# Altium schematic sheet schematic.SchDoc
size A4; SheetNumber: 1; SheetTotal: 1
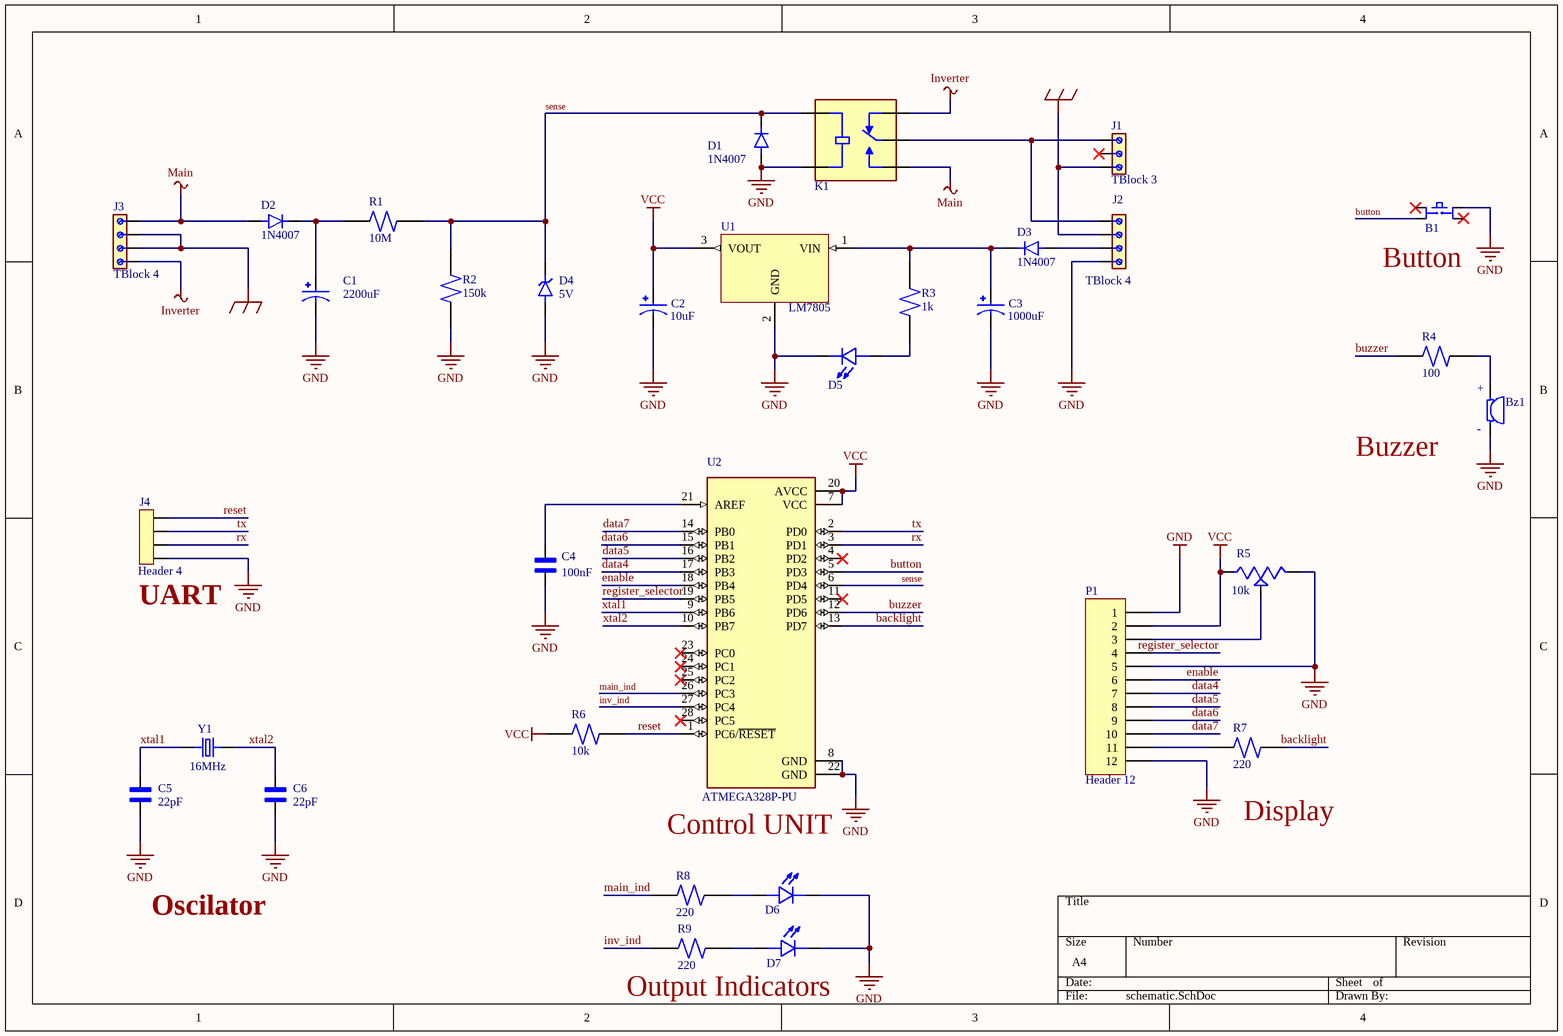
[diagram p0: schematic.SchDoc]

## Parts
B1  Push button  [SW_TS02-66-95-BK-260-LCR-D]  (value not drawn)
Bz1  AI-1223-TWT-12V-R  [XDCR_AI-1223-TWT-12V-R]  (value not drawn)
C1  2200uF  [CAPPRD750W80D1600H2500]
C2  10uF  [CAPPRD500W50D500H1100]
C3  1000uF  [CAPPRD500W50D500H1100]
C4  100nF  [CAPRB500W50L450T300H550]
C5  22pF  [CAPRB500W50L450T300H550]
C6  22pF  [CAPRB500W50L450T300H550]
D1  1N4007  [DIOAD1060W80L520D270]
D2  1N4007  [DIOAD1060W80L520D270]
D3  1N4007  [DIOAD1060W80L520D270]
D4  5V  [DIOAD1060W70L435D230]
D5  L08R5000Q1  [LEDRD254W57D500H1070]  (value not drawn)
D6  L08R5000Q1  [LEDRD254W57D500H1070]  (value not drawn)
D7  L08R5000Q1  [LEDRD254W57D500H1070]  (value not drawn)
J1  TBlock 3  [Terminal block - 3Pins]
J2  TBlock 4  [691241510004]
J3  TBlock 4  [691241510004]
J4  Header 4  [SULLINS_PPTC041LFBN-RC]
K1  JQC-3F-1C-24VDC  [RELAY_JQC-3F-1C-24VDC]  (value not drawn)
P1  Header 12  [HDR1X12]
R1  10M  [RESAD1100W55L680D260]
R2  150k  [RESAD1100W55L680D260]
R3  1k  [RESAD1100W55L680D260]
R4  100  [RESAD1100W55L680D260]
R5  10k  [TRIM_3306F-1-105]
R6  10k  [RESAD1100W55L680D260]
R7  220  [RESAD1100W55L680D260]
R8  220  [RESAD1100W55L680D260]
R9  220  [RESAD1100W55L680D260]
U1  LM7805  [TO255P1020X450X1968-3]
U2  ATMEGA328P-PU  [DIP794W46P254L2967H457Q28B]
Y1  16MHz  [XTAL_ECS-160-20-4X]

## Nets
AGND: J1.3 J2.2 J3.2 J3.3
GND: B1.3 Bz1.N(NEG) C1.N C2.N C3.N C4.1 C5.1 C6.1 D1.A D4.A D5.C D6.C D7.C J2.4 J4.4 K1.COIL2 P1.1 P1.5 P1.12 R2.2 R5.3(CW) U1.2(GND) U2.8(GND) U2.22(GND)
Inverter: J3.4 K1.NC
Main: D2.A J3.1 K1.NO
VCC: C2.P P1.2 R5.1(CCW) R6.2 U1.3(VOUT) U2.7(VCC) U2.20(AVCC)
backlight: R7.2 U2.13(PD7)
button: B1.2 U2.5(PD3)
buzzer: R4.1 U2.12(PD6)
data4: P1.7 U2.17(PB3)
data5: P1.8 U2.16(PB2)
data6: P1.9 U2.15(PB1)
data7: P1.10 U2.14(PB0)
enable: P1.6 U2.18(PB4)
inv_ind: R9.2 U2.27(PC4)
main_ind: R8.2 U2.26(PC3)
register_selector: P1.4 U2.19(PB5)
reset: J4.1 R6.1 U2.1(PC6/~{RESET})
rx: J4.3 U2.3(PD1)
sense: D1.C D4.C(K) K1.COIL1 R1.1 R2.1 U2.6(PD4)
tx: J4.2 U2.2(PD0)
xtal1: C5.2 U2.9(PB6) Y1.2
xtal2: C6.2 U2.10(PB7) Y1.1
NetBz1_P: Bz1.P(POS) R4.2
NetC1_P: C1.P D2.C R1.2
NetC3_P: C3.P D3.C R3.2 U1.1(VIN)
NetC4_2: C4.2 U2.21(AREF)
NetD3_A: D3.A J2.3
NetD5_A: D5.A R3.1
NetD6_A: D6.A R8.1
NetD7_A: D7.A R9.1
NetJ1_1: J1.1 J2.1 K1.COM
NetP1_3: P1.3 R5.2(WIPER)
NetP1_11: P1.11 R7.1

Not connected (* = marked no-connect by the designer): B1 1* 4*; J1 2*; U2 4(PD2)* 11(PD5)* 23(PC0)* 24(PC1)* 25(PC2)* 28(PC5)*

## Notes on the sheet
- (near B1) Button
- Buzzer
- (near J4) UART
- Control UNIT
- (near R7) Display
- Oscilator
- Output Indicators
- (in symbol Buzzer) +; -

## Library data of the parts
Bz1 = Buzzer: ELECTRO-MECHANICAL AUDIO INDICATOR; MF: PUI Audio,; Availability: In Stock; Package: 2225 PUI Audio; Value: *; Price: None; MP: AI-1223-TWT-12V-R; Purchase-URL: https://pricing.snapeda.com/search/part/AI-1223-TWT-12V-R/?ref=eda
C1 = Capacitor (16 x 25mm): Cap Aluminum 33uF 400V 20% (16 X 25mm) Radial Aluminum Cylindrical Can 7.5mm 275mA 2000 hr 85Â°C Bulk; MF: Panasonic; MP: ECA2GM330; Value: *; Price: None; Package: RADIAL-2 Panasonic; Check_prices: https://www.snapeda.com/parts/ECA2GM330/Panasonic/view-part/5790262/?ref=eda; Availability: In Stock; SnapEDA_Link: https://www.snapeda.com/parts/ECA2GM330/Panasonic/view-part/5790262/?ref=snap; Purchase-URL: https://pricing.snapeda.com/search/part/ECA2GM330/?ref=eda
C2 C3 = Electrolytic capacitor: FS-A; MF: {'manufacturer': u'Panasonic'}; MP: EEUFS0J221B; Package: None; Value: *; Availability: Unavailable; Price: None
C4-C6 = Ceramic capacitor: 2200 pF Â±10% 250V Ceramic Capacitor X7R Radial; MF: TDK; MP: FG24X7R2E222KNT06; Digi-Key_Part_Number: 445-173386-1-ND; Purchase-URL: https://pricing.snapeda.com/search/part/FG24X7R2E222KNT06/?ref=eda; Check_prices: https://www.snapeda.com/parts/FG24X7R2E222KNT06/TDK/view-part/?ref=eda; Value: *; Package: Radial TDK; SnapEDA_Link: https://www.snapeda.com/parts/FG24X7R2E222KNT06/TDK/view-part/?ref=snap
D1-D3 = 1N4007: Diode Switching 1KV 1A 2-Pin DO-41; Price: None; MP: 1N4007; Value: *; Availability: Unavailable; Package: None
D4 = Zenner diode: Zener Diode 16V 1W Â±5% Through Hole DO-204AL (DO-41); MP: 1N4745A; MF: ON Semiconductor; Purchase-URL: https://pricing.snapeda.com/search/part/1N4745A/?ref=eda; Check_prices: https://www.snapeda.com/parts/1N4745A/Onsemi/view-part/?ref=eda; Availability: In Stock; Value: *; Price: None; Package: DO-41-2 ON Semiconductor; SnapEDA_Link: https://www.snapeda.com/parts/1N4745A/Onsemi/view-part/?ref=snap
D5-D7 = LED: LED, Orange, Through Hole, T-1 3/4 (5mm), 30 mA, 2.1 V, 635 nm; MF: {'manufacturer': u'LED Technology'}; Price: None; Package: None; Availability: Unavailable; MP: L08R5000Q1; Value: *
J1 = 3Pins Terminal block: 5.08 MM TERMINAL BLOCK;; MP: 691216510003S; MF: Wurth Electronics; Package: None; Purchase-URL: https://pricing.snapeda.com/search/part/691216510003S/?ref=eda; Check_prices: https://www.snapeda.com/parts/691216510003S/Wurth+Electronics+Inc/view-part/?ref=eda; Availability: In Stock; Price: None; SnapEDA_Link: https://www.snapeda.com/parts/691216510003S/Wurth+Electronics+Inc/view-part/?ref=snap; Value: *
J2 J3 = Terminal block - 4Pins: <b>WR-TBL Serie 2415 - 5.08 mm Horizontal Entry Modular w. Rising Cage Clamp</b> <br> <br><b> KIND PROPERTIES </b> <br><br> Pitch 5.08 mm  <br> <br> <b>MATERIAL PROPERTIES </b> <br> <br>Insulator Material PA66  <br>Insulator Flammability Rating UL94 V-0  <br>Terminal Screw Material Steel  <br>Terminal Screw Plating Zinc  <br>Wire Guard Material Copper Alloy  <br> <br> <b>GENERAL INFORMATION </b> <br> <br>Operating Temperature -30 up to +120 Â°C  <br>Compliance ROHS & Reach  <br><br> <b>ELECTRICAL PROPERTIES </b> <br> <br>IR UL 14 A  <br>IR VDE 24 A  <br>Working Voltage [UL] 300 V (AC)  <br>Working Voltage [VDE] 250 V (AC)  <br>Withstanding Voltage [UL] 1600 V (AC)  <br>Withstanding Voltage [VDE] 2000 V (AC)  <br>Contact Resistance 20 mÎ©  <br> <br> <b>MECHANICAL PROPERTIES </b> <br> <br>Wire Strip Length 6  <br>Screw M3  <br> <br> <b>CERTIFICATION </b> <br> <br>UL Approval E150931  <br>VDE Approval 40021365  <br> <br> <b>PACKAGING PROPERTIES </b> <br> <br>Packaging Box  <br> <br> <br><a href="https://www.we-online.com/catalog/media/o79416v209%20Family_WR-TBL_6912427000xx_6912425000xx.jpg" title="Enlarge picture"> <img src="https://www.we-online.com/catalog/media/o79416v209%20Family_WR-TBL_6912427000xx_6912425000xx.jpg" width="320"></a><p> Details see: <a href="https://www.we-online.com/catalog/en/TBL_5_08_2415_HORIZONTAL_ENTRY_W_RISING_CAGE_6912415100xx/">https://www.we-online.com/catalog/en/TBL_5_08_2415_HORIZONTAL_ENTRY_W_RISING_CAGE_6912415100xx/</a><p>  </b>Updated by Ella Wu  2019-11-26<br> </b>2019(C) Wurth Elektronik; MF: WÃ¼rth Elektronik; MP: 691241510004; SnapEDA_Link: https://www.snapeda.com/parts/691241510004/Wurth+Electronics+Inc./view-part/?ref=snap; Availability: In Stock; Package: None; Purchase-URL: https://pricing.snapeda.com/search/part/691241510004/?ref=eda; Check_prices: https://www.snapeda.com/parts/691241510004/Wurth+Electronics+Inc./view-part/?ref=eda; Value: *; Price: None
J4 = Female header - 4Pins: 4 Position Header Connector Through Hole; MP: PPTC041LFBN-RC; MF: Sullins Connector; Value: *; SnapEDA_Link: https://www.snapeda.com/parts/PPTC041LFBN-RC/Sullins%20Connector%20Solutions/view-part/285917/?ref=snap; Package: None; Availability: Warning; Check_prices: https://www.snapeda.com/parts/PPTC041LFBN-RC/Sullins%20Connector%20Solutions/view-part/285917/?ref=eda; Price: None; Purchase-URL: https://pricing.snapeda.com/search/part/PPTC041LFBN-RC/?ref=eda
K1 = Relay (Standard): Miniature PCB Relay 24VDC, 10A 250VAC, 15A 125VAC, 10A 250VAC; Package: None; MP: JQC-3F-1C-24VDC; Value: *; Price: None; Availability: Unavailable
P1 = Header 12: Header, 12-Pin; LatestRevisionDate: 17-Jul-2002; LatestRevisionNote: Re-released for DXP Platform.; Publisher: Altium Limited
R1-R4 R6-R9 = Resistor (0.25W): (MFR-25FBF52-10K) 10,2 kOhm bei 1% 0,25W, 1/4W Durchbohrlochwiderstand Axial Metal Film; MF: Yageo; Digi-Key_Part_Number: 10.2KXBK-ND; SnapEDA_Link: https://www.snapeda.com/parts/MFR-25FBF52-10K/Yageo/view-part/424333/?ref=snap; Package: Axial Yageo; Purchase-URL: https://pricing.snapeda.com/search/part/MFR-25FBF52-10K/?ref=eda; MP: MFR-25FBF52-10K; Value: *
R5 = Potentiometer1: (3306F-1-105) 1 MOhms 0.2W, 1/5W PC Pins Through Hole Trimmer Potentiometer Cermet 1 Turn Top Adjustment; MF: Bourns; Check_prices: https://www.snapeda.com/parts/3306F-1-105/Bourns%20-%20J.W.%20Miller/view-part/862876/?ref=eda; Availability: Good; Value: *; Price: None; MP: 3306F-1-105; SnapEDA_Link: https://www.snapeda.com/parts/3306F-1-105/Bourns%20-%20J.W.%20Miller/view-part/862876/?ref=snap; Package: 3306F Bourns; Purchase-URL: https://pricing.snapeda.com/search/part/3306F-1-105/?ref=eda
U1 = LM78__: MP: LM7805CT/NOPB; Price: None; Value: *; Availability: Unavailable; Package: None
U2 = ATMEGA328P-PU: ATmega Series 20 MHz 32 KB Flash 2 KB SRAM 8-Bit Microcontroller - DIP-28; Value: *; MP: ATMEGA328P-PU; Package: None; Availability: Unavailable; Price: None
Y1 = Crystal oscilator: CRYSTAL T/H; MF: {'manufacturer': u'ECS Inc.'}; MP: ECS-160-S-4; Package: None; Value: *; Availability: Unavailable; Price: None